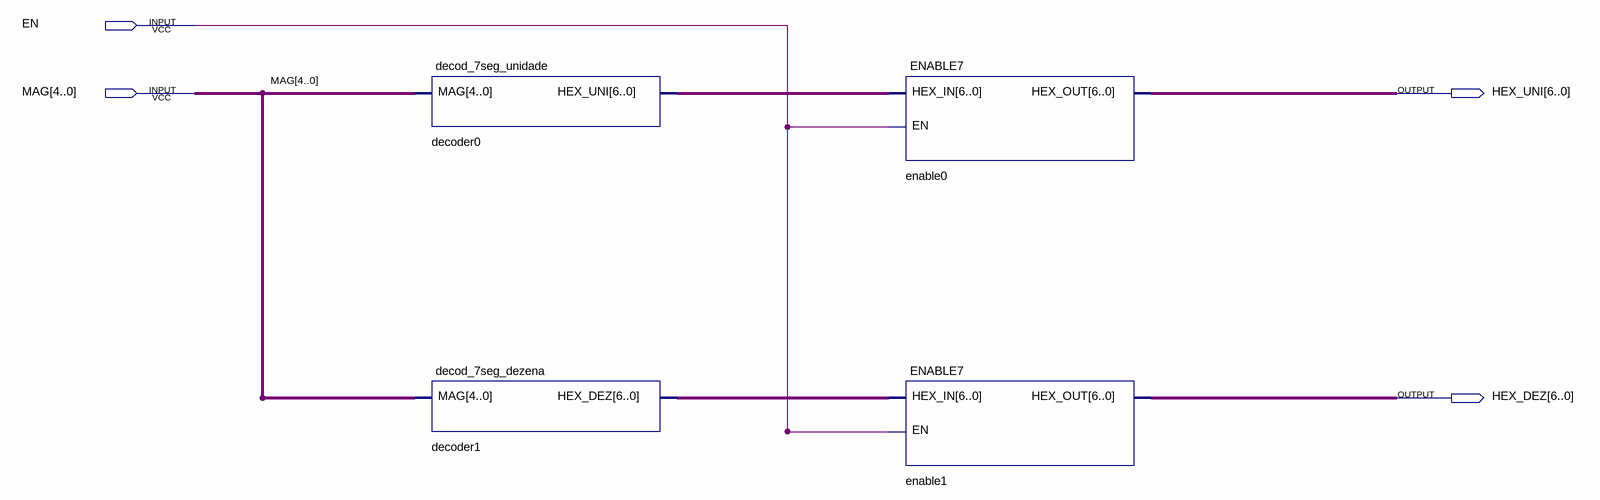
[diagram p0: schematic sheet]
// Quartus schematic decod_7seg_base.bdf as structural Verilog: 4 symbols, 4 pins
module decod_7seg_base (
  input  EN,
  input  [4:0] MAG,
  output [6:0] HEX_UNI,
  output [6:0] HEX_DEZ
);

  wire [6:0] decoder0_hex_uni, decoder1_hex_dez;

  decod_7seg_unidade decoder0 (.MAG(MAG), .HEX_UNI(decoder0_hex_uni));
  decod_7seg_dezena decoder1 (.MAG(MAG), .HEX_DEZ(decoder1_hex_dez));
  ENABLE7 enable0 (.HEX_IN(decoder0_hex_uni), .EN(EN), .HEX_OUT(HEX_UNI));
  ENABLE7 enable1 (.HEX_IN(decoder1_hex_dez), .EN(EN), .HEX_OUT(HEX_DEZ));
endmodule
